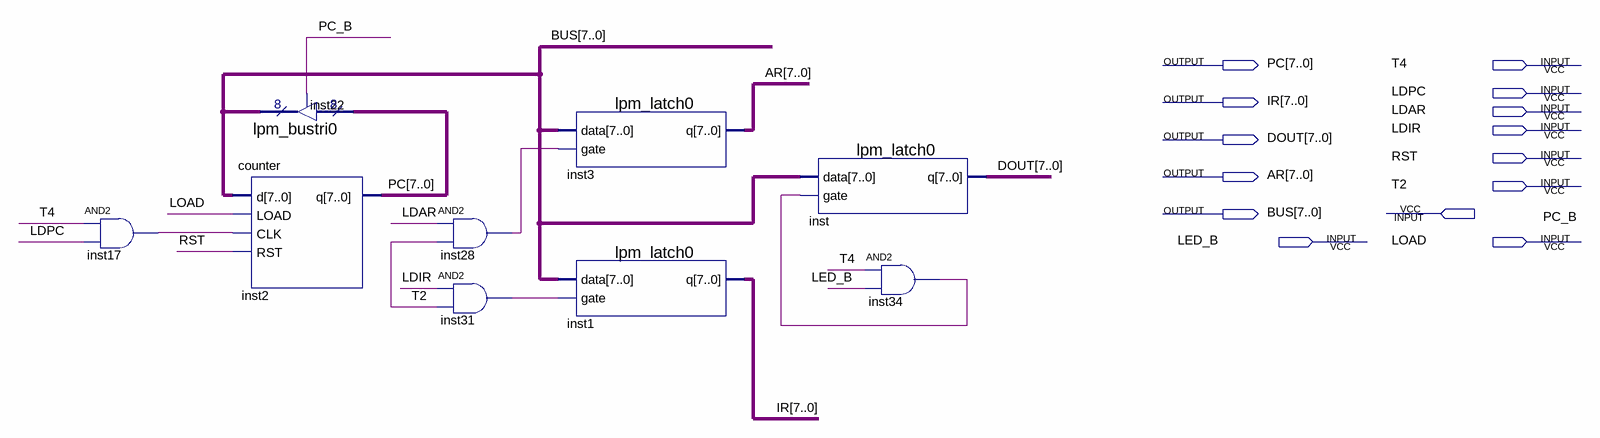
[diagram p0: schematic sheet]
// Quartus schematic REGS_MD.bdf as structural Verilog: 9 symbols, 14 pins
module REGS_MD (
  input  T4,
  input  LDPC,
  input  LDAR,
  input  LDIR,
  input  RST,
  input  T2,
  input  PC_B,
  input  LED_B,
  input  LOAD,
  output [7:0] PC,
  output [7:0] IR,
  output [7:0] DOUT,
  output [7:0] AR,
  output [7:0] BUS
);

  wire inst17_out, inst28_out, inst31_out, inst34_out;

  and inst17 (inst17_out, T4, LDPC);
  lpm_bustri0 inst22 (.enabledt(PC_B), .data(PC), .tridata(BUS));
  counter inst2 (.d(BUS), .LOAD(LOAD), .CLK(inst17_out), .RST(RST), .q(PC));
  and inst28 (inst28_out, LDAR, T2);
  and inst31 (inst31_out, LDIR, T2);
  lpm_latch0 inst3 (.data(BUS), .gate(inst28_out), .q(AR));
  lpm_latch0 inst1 (.data(BUS), .gate(inst31_out), .q(IR));
  lpm_latch0 inst (.data(BUS), .gate(inst34_out), .q(DOUT));
  and inst34 (inst34_out, T4, LED_B);
endmodule
